# EAGLE design harp behavior speaker v1.1 (EAGLE 6.5.0)
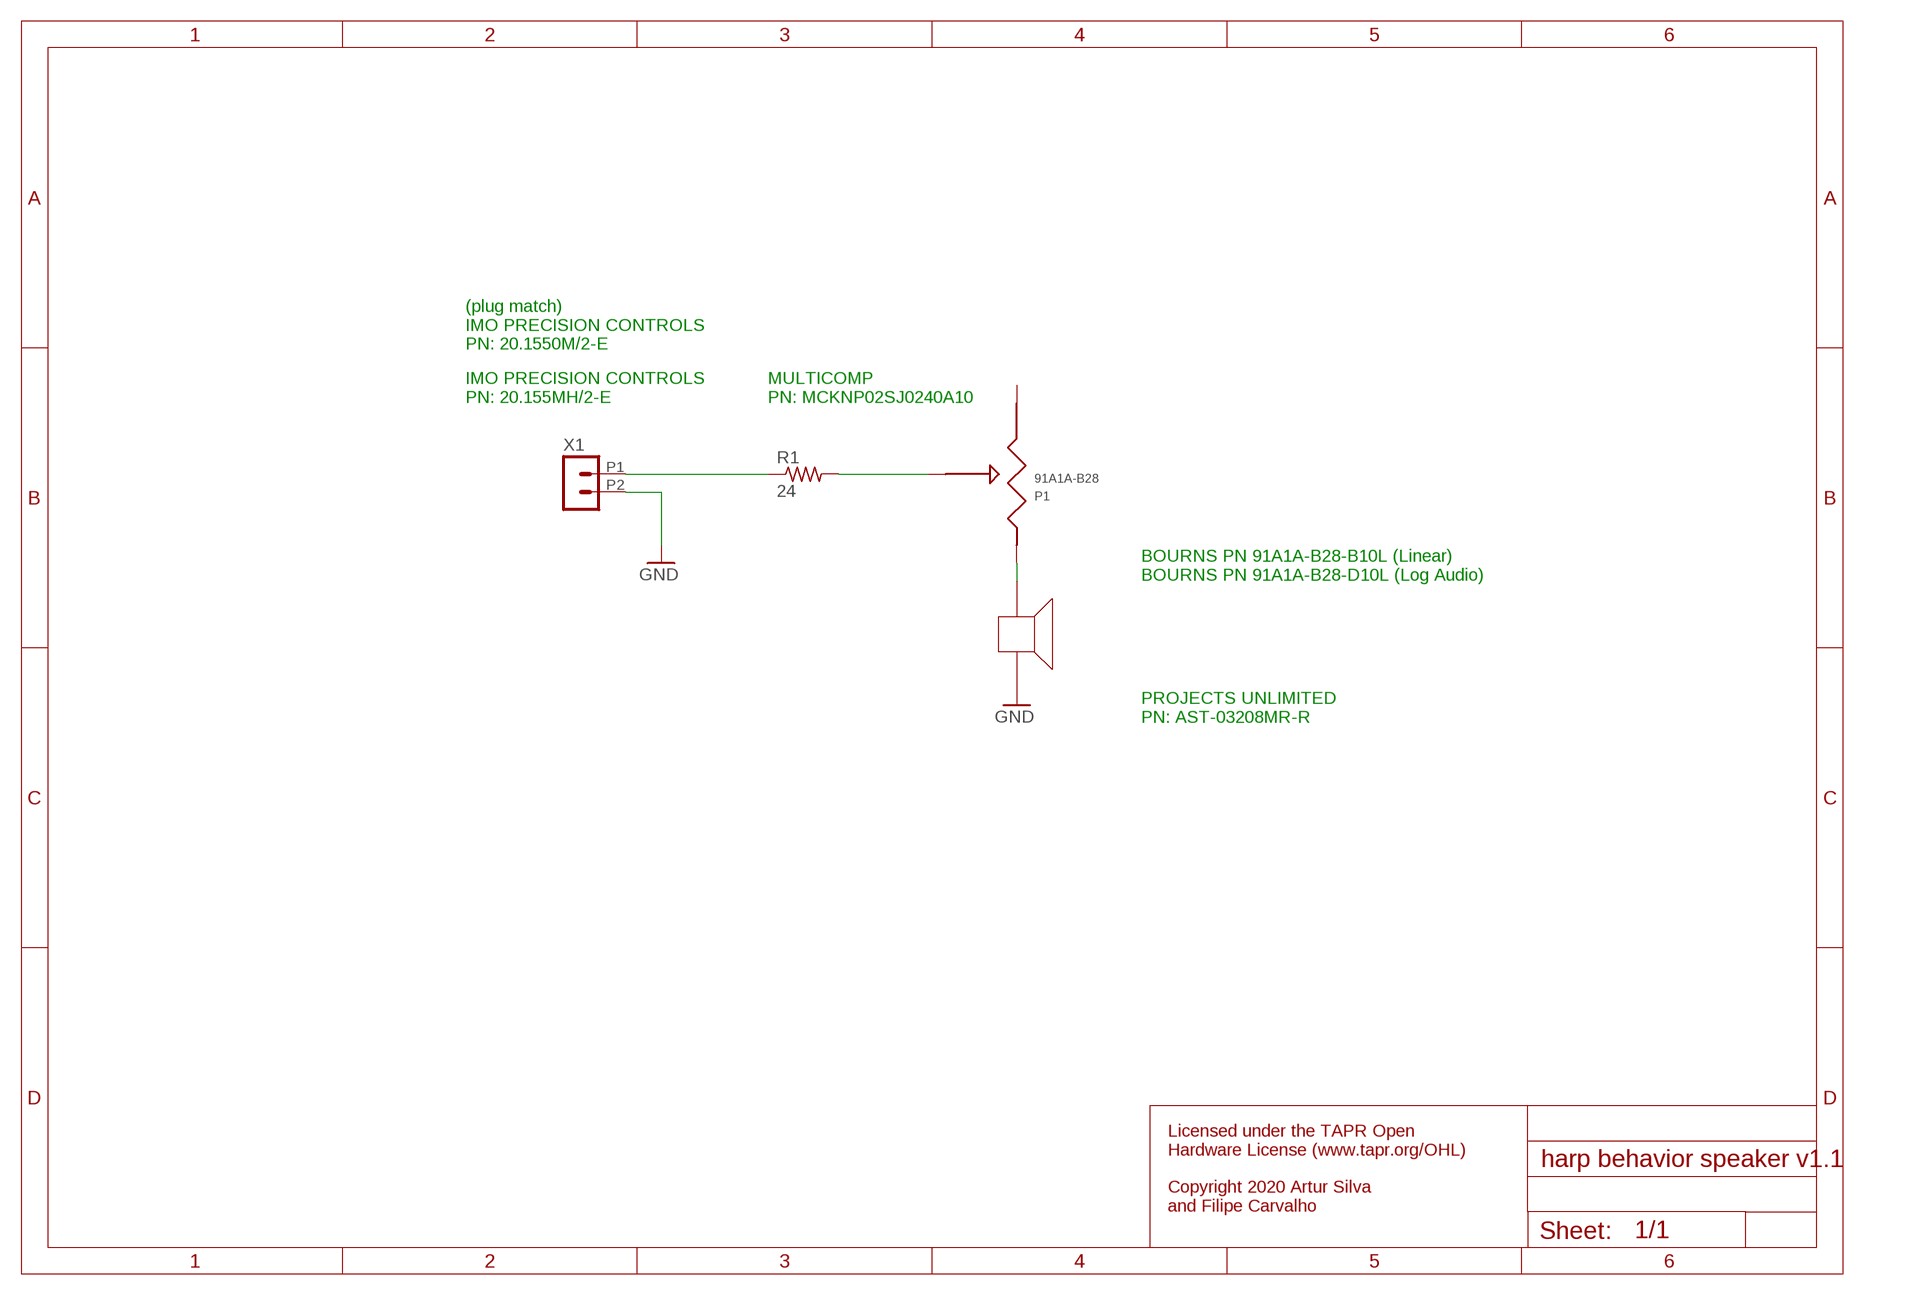
[diagram p0: schematic, sheet 1]

## Parts
P1  91A1A-B28  [MODEL91]
R1  24  R-US_0617/22  [0617/22]
X1  CON_3.5MM_1X2  [CON_3.5MM_1X2]

## Nets
GND: X1.P2
N$1: R1.1 X1.P1
N$2: P1.P$2 R1.2
SPEAKER: P1.P$1(1CCW)
Unconnected: P1.P$3

## Notes on the sheet
- (plug match)
  IMO PRECISION CONTROLS
  PN: 20.1550M/2-E
- IMO PRECISION CONTROLS
  PN: 20.155MH/2-E
- MULTICOMP
  PN: MCKNP02SJ0240A10
- BOURNS PN 91A1A-B28-B10L (Linear)
  BOURNS PN 91A1A-B28-D10L (Log Audio)
- PROJECTS UNLIMITED
  PN: AST-03208MR-R
- Licensed under the TAPR Open 
  Hardware License (www.tapr.org/OHL)
  
  Copyright 2020 Artur Silva 
  and Filipe Carvalho

## Library data of the parts
P1 = pot:91A1A-B28
R1 = resistor:R-US_: RESISTOR, American symbol
X1 = CNP-connectors:CON_3.5MM_1X2

## Board
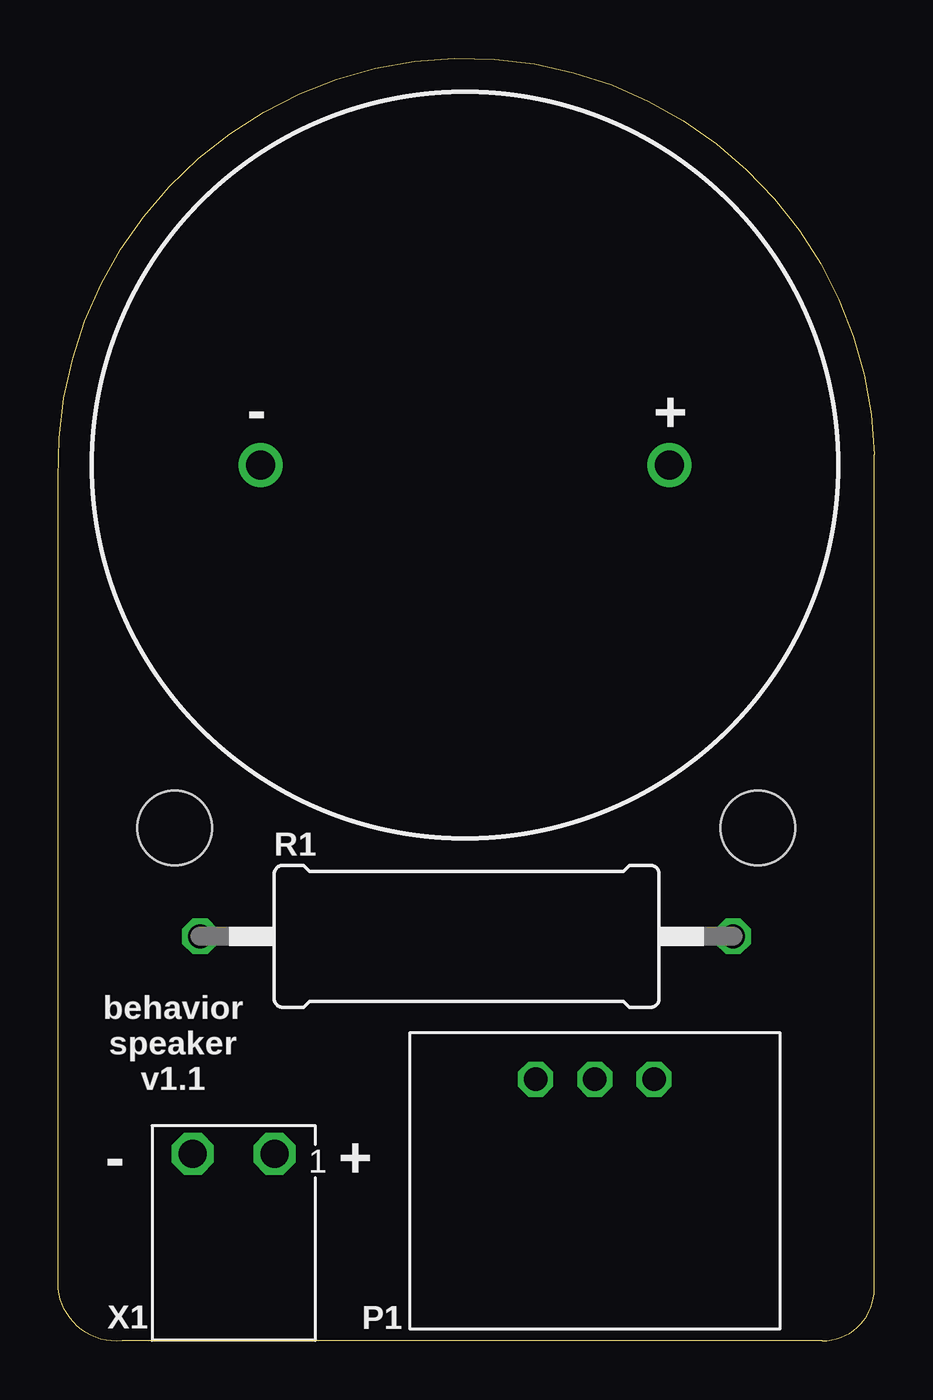
[diagram p1: board, top side]
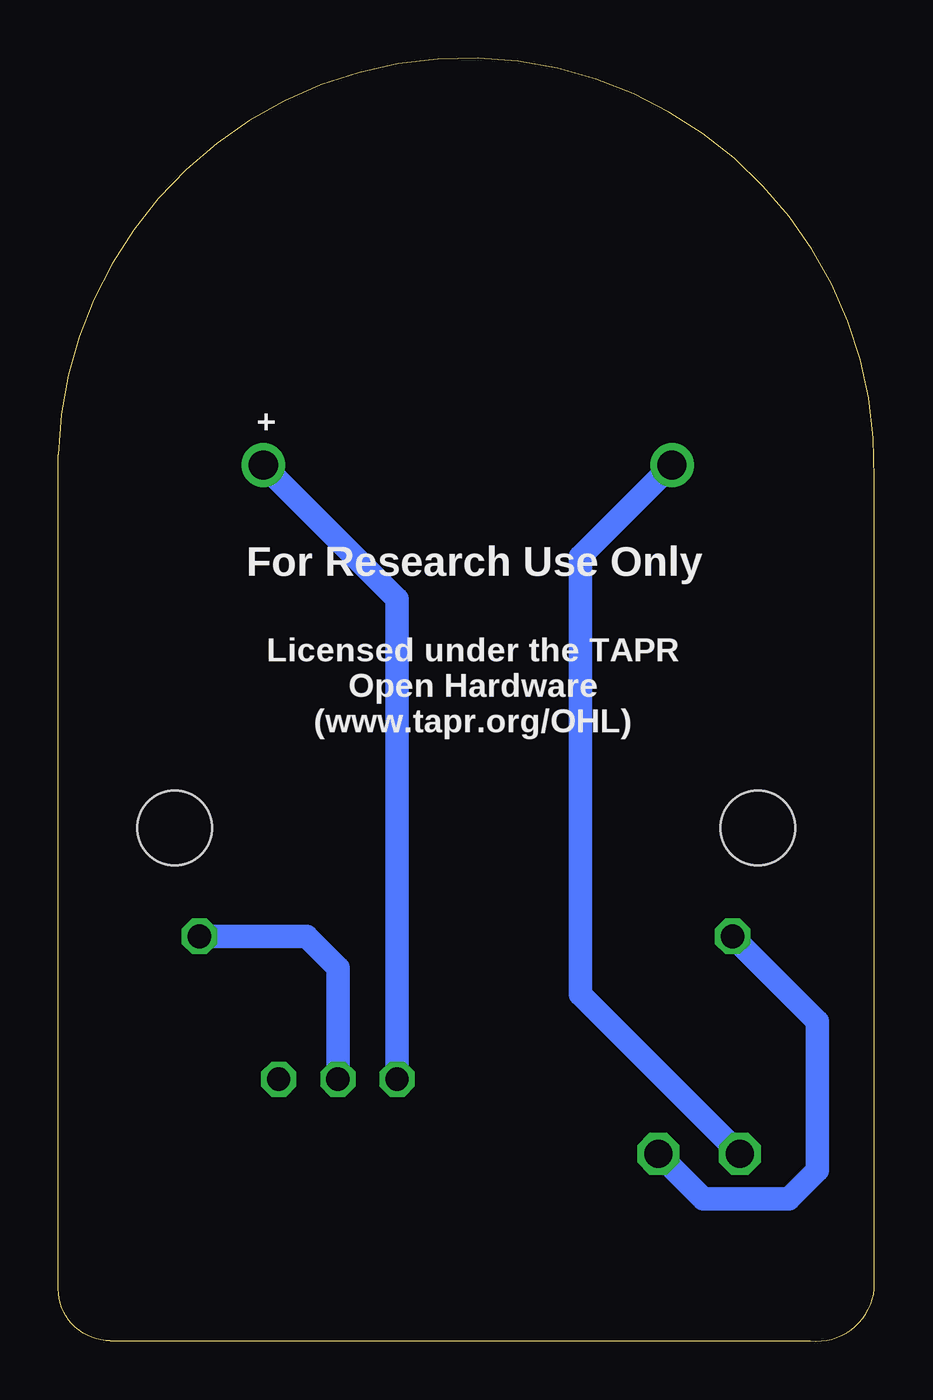
[diagram p2: board, bottom side, seen from below]

Size 35 x 55.01 mm. Coordinates in mm from the lower left corner, seen from the top.
Outline: 32.76,0.01 2.74,0.01 arc-90 0,2.25 0,37.01 arc-180 35,38.01 35,2.25 arc-90 32.76,0.01
Copper layers (1*16): Top 0.018mm / dielectric 1.55mm / Bottom 0.018mm
Design rules "eC_2Layer_PClass6_BaseCopperO18_eCDefault *": minimum track width 0.15mm, minimum drill 0.3mm, track to track 0.15mm, track to pad 0.15mm, pad to pad 0.15mm, via to via 0.15mm, smd to smd 0mil, copper to edge 0.25mm, drill to drill 0.35mm, minimum pad ring 0.175mm, minimum via ring 0.125mm, stop-mask expansion 0mil, vias tented up to drill 0.45mm, thermal gap 0.2mm
Holes 3.2 mm at 5,22.01 30,22.01
tRestrict: area 1.3,18.3 to 8.7,25.7; area 26.3,18.3 to 33.7,25.7
bRestrict: area 1.3,18.3 to 8.7,25.7; area 26.3,18.3 to 33.7,25.7

### Footprints (pad centres in the part's own frame; a part is rotated, then mirrored left to right if it is on the bottom)
MODEL91 = drill 1 octagon: P$1 -2.54,0; P$2 0,0; P$3 2.54,0
0617/22 = drill 1.016 octagon: 1 -11.43,0; 2 11.43,0
CON_3.5MM_1X2 = drill 1.2 octagon: P1 -1.75,0; P2 1.75,0

### Placement (x,y rotation side)
P1  23.01,11.23 0 top
R1  17.51,17.36 0 top
X1  7.52,8.03 180 top

### Tracks (layer width: path | path; a pad name or v marks a point on that pad's centre or on a via)
GND  (via drill 1.25)
  Bottom 1.016: v8.68,37.57 12.6,33.65 12.6,16.01 12.6,15.39 12.6,14.86 X1.P2
N$1
  Bottom 1.016: X1.P1 7.34,6.11 3.66,6.11 2.44,7.33 2.44,13.72 R1.1
N$2
  Bottom 1.016: R1.2 24.35,17.36 23,16.01 P1.P$2
SPEAKER  (via drill 1.25)
  Bottom 1.016: P1.P$1 20.47,31.84 v26.21,37.57

### Text on the board
tPlace: - | + | behavior / speaker / v1.1 | - | + | Licensed under the TAPR Open / Hardware License (www.tapr.org/OHL) / / Copyright 2020 Artur Silva and Filipe Carvalho
bPlace: + | For Research Use Only | Licensed under the TAPR / Open Hardware / (www.tapr.org/OHL)